# EAGLE design Sunrise (EAGLE 7.6.0)
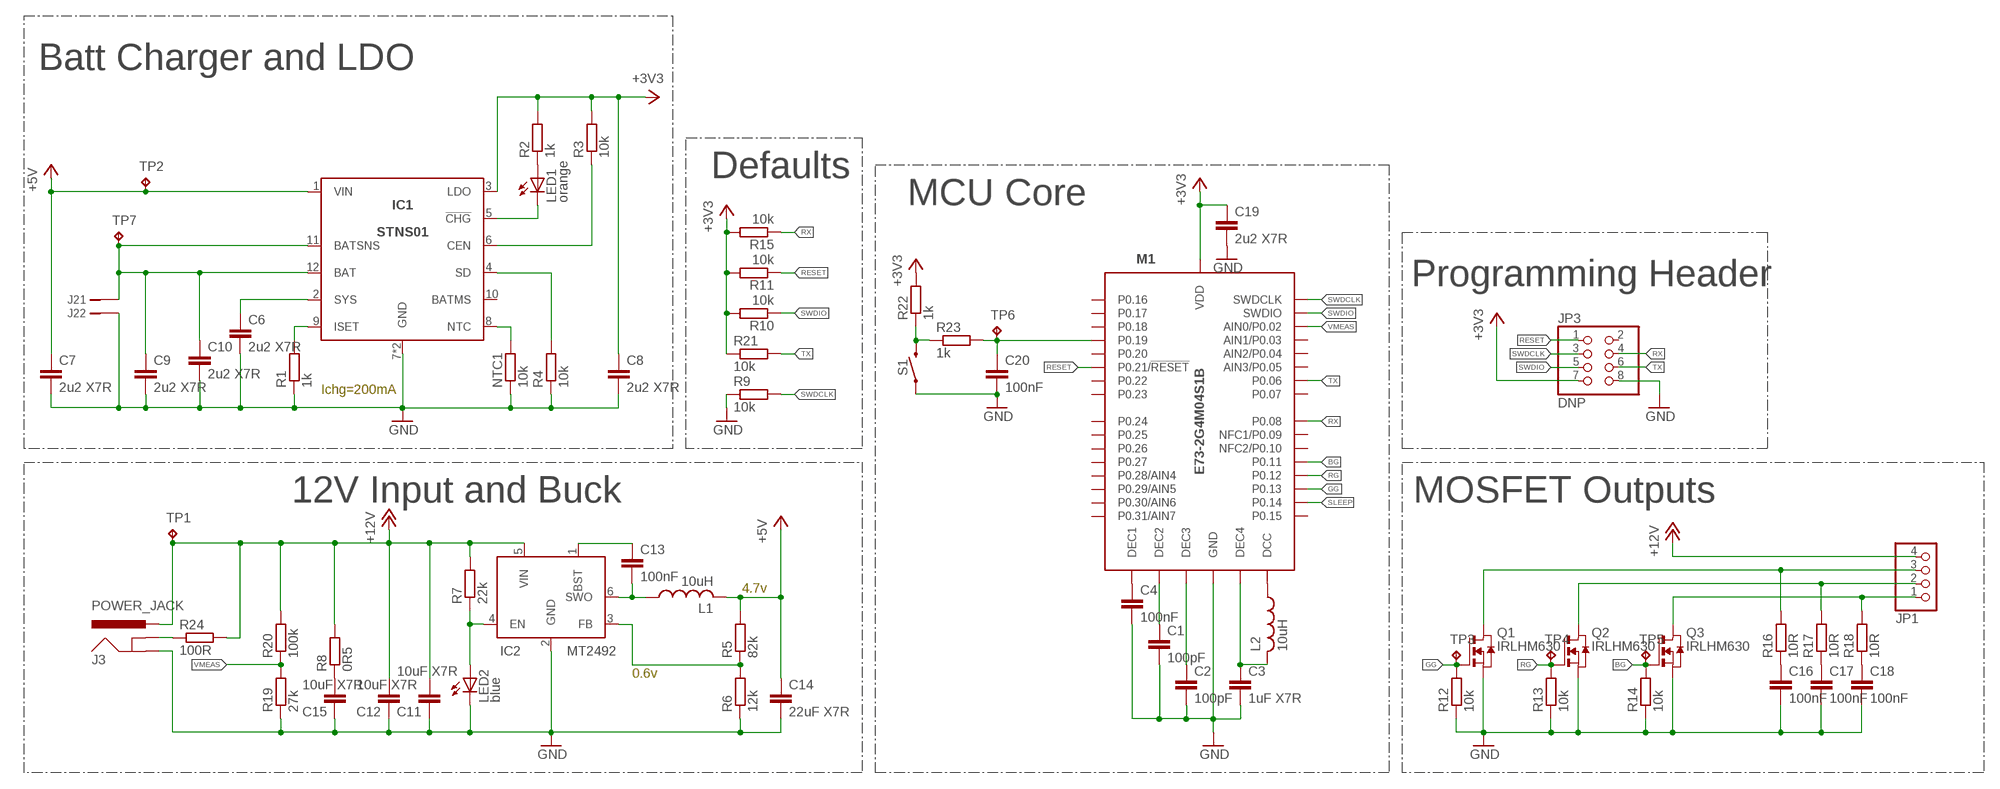
[diagram p0: schematic, sheet 1]

## Parts
C1  100pF  C-EUC0402K  [C0402K]
C2  100pF  C-EUC0402K  [C0402K]
C3  1uF X7R  C-EUC0603K  [C0603K]
C4  100nF  C-EUC0402K  [C0402K]
C6  2u2 X7R  C-EUC0603K  [C0603K]
C7  2u2 X7R  C-EUC0603K  [C0603K]
C8  2u2 X7R  C-EUC0603K  [C0603K]
C9  2u2 X7R  C-EUC0603K  [C0603K]
C10  2u2 X7R  C-EUC0603K  [C0603K]
C11  10uF X7R  C-EUC1206K  [C1206K]
C12  10uF X7R  C-EUC1206K  [C1206K]
C13  100nF  C-EUC0402K  [C0402K]
C14  22uF X7R  C-EUC1206K  [C1206K]
C15  10uF X7R  C-EUC1206K  [C1206K]
C16  100nF  C-EUC0402K  [C0402K]
C17  100nF  C-EUC0402K  [C0402K]
C18  100nF  C-EUC0402K  [C0402K]
C19  2u2 X7R  C-EUC0603K  [C0603K]
C20  100nF  C-EUC0402K  [C0402K]
IC1  STNS01  [DFN12L-3MM]
IC2  MT2492  [SOT23-6]
J2  B2B-PH-K-S  [B2B-PH-K-S]
J3  POWER_JACK  [POWER_JACK_PTH]
JP1  PINHD-1X4/90  [1X04/90]
JP3  DNP  PINHD-2X4  [2X04]
L1  10uH  INDUCTOR5050  [2020-5050]
L2  10uH  INDUCTOR1608  [0603-1608]
LED1  orange  LEDCHIP-LED0603  [CHIP-LED0603]
LED2  blue  LEDCHIP-LED0603  [CHIP-LED0603]
M1  E73-2G4M04S1B  [E73-2GM404S]
NTC1  10k  R-EU_R0402  [R0402]
Q1  IRLHM630  NMOS-MLP8-33  [MLP8-33]
Q2  IRLHM630  NMOS-MLP8-33  [MLP8-33]
Q3  IRLHM630  NMOS-MLP8-33  [MLP8-33]
R1  1k  R-EU_R0402  [R0402]
R2  1k  R-EU_R0402  [R0402]
R3  10k  R-EU_R0402  [R0402]
R4  10k  R-EU_R0402  [R0402]
R5  82k  R-EU_R0402  [R0402]
R6  12k  R-EU_R0402  [R0402]
R7  22k  R-EU_R0402  [R0402]
R8  0R5  R-EU_R0402  [R0402]
R9  10k  R-EU_R0402  [R0402]
R10  10k  R-EU_R0402  [R0402]
R11  10k  R-EU_R0402  [R0402]
R12  10k  R-EU_R0402  [R0402]
R13  10k  R-EU_R0402  [R0402]
R14  10k  R-EU_R0402  [R0402]
R15  10k  R-EU_R0402  [R0402]
R16  10R  R-EU_R0402  [R0402]
R17  10R  R-EU_R0402  [R0402]
R18  10R  R-EU_R0402  [R0402]
R19  27k  R-EU_R0402  [R0402]
R20  100k  R-EU_R0402  [R0402]
R21  10k  R-EU_R0402  [R0402]
R22  1k  R-EU_R0402  [R0402]
R23  1k  R-EU_R0402  [R0402]
R24  100R  R-EU_R0402  [R0402]
S1  MOMENTARY-SWITCH-SPST-SMD-5.2MM  [TACTILE_SWITCH_SMD_5.2MM]
TP1  TPTP10R  [TP10R]
TP2  TPTP10R  [TP10R]
TP3  TPTP10R  [TP10R]
TP4  TPTP10R  [TP10R]
TP5  TPTP10R  [TP10R]
TP6  TPTP10R  [TP10R]
TP7  TPTP10R  [TP10R]

## Nets
+3V3: C8.1 C19.1 IC1.3(LDO) JP3.7 M1.16(VDD) R2.2 R3.2 R10.2 R11.2 R15.2 R21.1 R22.2
+5V: C7.1 C14.1 IC1.1(VIN) L1.2 R5.2 TP2.TP
+12V: C11.1 C12.1 IC2.5(VIN) J3.PWR JP1.4 R7.2 R8.2 R20.2 R24.2 TP1.TP
BG: M1.26(P0.11) Q3.GATE(G) R14.2 TP5.TP
GG: M1.28(P0.13) Q1.GATE(G) R12.2 TP3.TP
GND: C1.2 C2.2 C3.2 C4.2 C6.2 C7.2 C8.2 C9.2 C10.2 C11.2 C12.2 C14.2 C15.2 C16.2 C17.2 C18.2 C19.2 C20.2 IC1.7(GND) IC1.PAD(GND) IC2.2(GND) J2.2 J3.GND JP3.8 LED2.C M1.0(GND) M1.1(GND) M1.2(GND) M1.15(GND) M1.42(GND) M1.43(GND) NTC1.1 Q1.S1(S) Q1.S2(S) Q1.S3(S) Q2.S1(S) Q2.S2(S) Q2.S3(S) Q3.S1(S) Q3.S2(S) Q3.S3(S) R1.1 R4.1 R6.1 R9.1 R12.1 R13.1 R14.1 R19.1 S1.1
N$1: C4.1 M1.14(DEC1)
N$2: C1.1 M1.3(DEC2)
N$3: C3.1 L2.2 M1.12(DEC4)
N$4: C2.1 M1.4(DEC3)
N$5: L2.1 M1.13(DCC)
N$6: C9.1 C10.1 IC1.11(BATSNS) IC1.12(BAT) J2.1 TP7.TP
N$7: C6.1 IC1.2(SYS)
N$8: IC1.8(NTC) NTC1.2
N$9: IC1.9(ISET) R1.2
N$10: LED1.A R2.1
N$11: IC1.5(!CHG) LED1.C
N$12: IC1.6(CEN) R3.1
N$13: IC1.4(SD) R4.2
N$14: C15.1 R8.1
N$15: JP1.1 Q3.D1(D) Q3.D2(D) Q3.D3(D) Q3.D4(D) Q3.DRAIN0(D) R18.2
N$16: JP1.2 Q2.D1(D) Q2.D2(D) Q2.D3(D) Q2.D4(D) Q2.DRAIN0(D) R17.2
N$17: C13.1 IC2.1(BST)
N$18: IC2.3(FB) R5.1 R6.2
N$19: JP1.3 Q1.D1(D) Q1.D2(D) Q1.D3(D) Q1.D4(D) Q1.DRAIN0(D) R16.2
N$20: C13.2 IC2.6(SWO) L1.1
N$21: IC2.4(EN) LED2.A R7.1
N$22: C16.1 R16.1
N$23: C17.1 R17.1
N$24: C18.1 R18.1
N$25: R22.1 R23.1 S1.3
N$26: C20.1 M1.34(P0.19) R23.2 TP6.TP
N$27: J3.GNDBREAK R24.1
RESET: JP3.1 M1.36(P0.21/!RESET) R11.1
RG: M1.27(P0.12) Q2.GATE(G) R13.2 TP4.TP
RX: JP3.4 M1.23(P0.08) R15.1
SLEEP: M1.29(P0.14)
SWDCLK: JP3.3 M1.37(SWDCLK) R9.2
SWDIO: JP3.5 M1.38(SWDIO) R10.1
TX: JP3.6 M1.21(P0.06) R21.2
VMEAS: M1.17(AIN0/P0.02) R19.2 R20.1
Unconnected: IC1.10(BATMS) JP3.2 M1.5(P0.25) M1.6(P0.26) M1.7(P0.27) M1.8(P0.28/AIN4) M1.9(P0.29/AIN5) M1.10(P0.30/AIN6) M1.11(P0.31/AIN7) M1.18(AIN1/P0.03) M1.19(AIN2/P0.04) M1.20(AIN3/P0.05) M1.22(P0.07) M1.24(NFC1/P0.09) M1.25(NFC2/P0.10) M1.30(P0.15) M1.31(P0.16) M1.32(P0.17) M1.33(P0.18) M1.35(P0.20) M1.39(P0.22) M1.40(P0.23) M1.41(P0.24)

## Notes on the sheet
- Batt Charger and LDO
- Defaults
- MCU Core
- Programming Header
- Ichg=200mA
- 12V Input and Buck | MOSFET Outputs
- 4.7v
- 0.6v

## Library data of the parts
C1-C4 C6-C20 = rcl:C-EU: CAPACITOR, European symbol
IC1 = STNS01:STNS01; MF: ST; MPN: STNS01
IC2 = MT2492:MT2492; MF: Monolithic Power; MPN: MT2492
J2 = con-JST-PH:B2B-PH-K-S: JST-PH 2-way vertical TH; MF: JST; MPN: B2B-PH-K-S
J3 = SparkFun-Connectors:POWER_JACK: Power Jack Connector This is the standard 5.5mm barrel jack for power. The PTH is the most common, proven, reliable, footprint. The Slot footprint only works if the mill layer is transmitted to the PCB fab house so be warned. Here are the connectors we sell at SparkFun: DC Barrel Power Jack/Connector <https://www.sparkfun.com/products/119> (PRT-00119) DC Barrel Power Jack/Connector (SMD) <https://www.sparkfun.com/products/12748> (PRT-12748) DC Barrel Jack Adapter - Breadboard Compatible <https://www.sparkfun.com/products/10811> (PRT-10811) It is used on this SparkFun product (and many, many others): SparkFun RedBoard - Programmed with Arduino <https://www.sparkfun.com/products/12757> (DEV-12757) Also, if you need a mating power supply or connector, please check these out: Wall Adapter Power Supply - 9VDC 650mA <https://www.sparkfun.com/products/298> (TOL-00298) DC Barrel Jack Adapter - Male <https://www.sparkfun.com/products/10287> (PRT-10287); PROD_ID: CONN-08197
JP1 = pinhead:PINHD-1X4: PIN HEADER
JP3 = pinhead:PINHD-2X4: PIN HEADER
L1 = inductors-murata:INDUCTOR; MF: Murata; MPN: LQH5BPN100MT0
L2 = inductors-murata:INDUCTOR; CURRENT: >50mA
LED1 LED2 = led:LED: LED OSRAM: - CHIPLED LG R971, LG N971, LY N971, LG Q971, LY Q971, LO R971, LY R971 LH N974, LH R974 LS Q976, LO Q976, LY Q976 LO Q996 - Hyper CHIPLED LW Q18S LB Q993, LB Q99A, LB R99A - SideLED LS A670, LO A670, LY A670, LG A670, LP A670 LB A673, LV A673, LT A673, LW A673 LH A674 LY A675 LS A676, LA A676, LO A676, LY A676, LW A676 LS A679, LY A679, LG A679 - Hyper Micro SIDELED® LS Y876, LA Y876, LO Y876, LY Y876 LT Y87S - SmartLED LW L88C, LW L88S LB L89C, LB L89S, LG L890 LS L89K, LO L89K, LY L89K LS L896, LA L896, LO L896, LY L896 - TOPLED LS T670, LO T670, LY T670, LG T670, LP T670 LSG T670, LSP T670, LSY T670, LOP T670, LYG T670 LG T671, LOG T671, LSG T671 LB T673, LV T673, LT T673, LW T673 LH T674 LS T676, LA T676, LO T676, LY T676, LB T676, LH T676, LSB T676, LW T676 LB T67C, LV T67C, LT T67C, LS T67K, LO T67K, LY T67K, LW E67C LS E67B, LA E67B, LO E67B, LY E67B, LB E67C, LV E67C, LT E67C LW T67C LS T679, LY T679, LG T679 LS T770, LO T770, LY T770, LG T770, LP T770 LB T773, LV T773, LT T773, LW T773 LH T774 LS E675, LA E675, LY E675, LS T675 LS T776, LA T776, LO T776, LY T776, LB T776 LHGB T686 LT T68C, LB T68C - Hyper Mini TOPLED® LB M676 - Mini TOPLED Santana® LG M470 LS M47K, LO M47K, LY M47K Source: http://www.osram.convergy.de LUXEON: - LUMILED® LXK2-PW12-R00, LXK2-PW12-S00, LXK2-PW14-U00, LXK2-PW14-V00 LXK2-PM12-R00, LXK2-PM12-S00, LXK2-PM14-U00 LXK2-PE12-Q00, LXK2-PE12-R00, LXK2-PE12-S00, LXK2-PE14-T00, LXK2-PE14-U00 LXK2-PB12-K00, LXK2-PB12-L00, LXK2-PB12-M00, LXK2-PB14-N00, LXK2-PB14-P00, LXK2-PB14-Q00 LXK2-PR12-L00, LXK2-PR12-M00, LXK2-PR14-Q00, LXK2-PR14-R00 LXK2-PD12-Q00, LXK2-PD12-R00, LXK2-PD12-S00 LXK2-PH12-R00, LXK2-PH12-S00 LXK2-PL12-P00, LXK2-PL12-Q00, LXK2-PL12-R00 Source: www.luxeon.com KINGBRIGHT: KA-3528ASYC Source: www.kingbright.com
M1 = E73-2G4M04S:E73-2G4M04S: NRF52 Module With Antenna variants: 1A: NRF52810 <http://www.ebyte.com/product-view-news.aspx?id=305> FLASH: 192kb RAM: 24kb CORE: ARM Cortex-M4 1B: NRF52832 <http://www.ebyte.com/product-view-news.aspx?id=239> FLASH: 512kb RAM: 64kb CORE: ARM Cortex-M4F 1C: NRF52840 <http://www.ebyte.com/product-view-news.aspx?id=444> FLASH: 1024kb RAM: 256kb CORE: ARM Cortex-M4; MF: Chengdu Ebyte; MPN: E7302G4M04S1B
NTC1 R1-R24 = rcl:R-EU_: RESISTOR, European symbol
Q1-Q3 = MOSFET:NMOS; MF: International Rectifier; MPN: IRLHM630TRPbF
S1 = SparkFun-Switches:MOMENTARY-SWITCH-SPST: Momentary Switch (Pushbutton) - SPST Normally-open (NO) SPST momentary switches (buttons, pushbuttons). Variants PTH-12MM - 12mm square, through-hole Momentary Pushbutton Switch - 12mm Square <https://www.sparkfun.com/products/9190> (COM-09190) PTH-6.0MM, PTH-6.0MM-KIT - 6.0mm square, through-hole Mini Pushbutton Switch <https://www.sparkfun.com/products/97> (COM-00097) KIT package intended for soldering kit's - only one side of pads' copper is exposed. PTH-RIGHT-ANGLE-KIT - Right-angle, through-hole Right Angle Tactile Button <https://www.sparkfun.com/products/10791> - Used on SparkFun BigTime Watch Kit <https://www.sparkfun.com/products/11734> SMD-12MM - 12mm square, surface-mount Tactile Button - SMD (12mm) <https://www.sparkfun.com/products/12993> (COM-12993) Used on SparkFun PicoBoard <https://www.sparkfun.com/products/11888> SMD-4.5MM - 4.5mm Square Trackball Switch Used on SparkFun Blackberry Trackballer Breakout <https://www.sparkfun.com/products/13169> SMD-4.6MMX2.8MM - 4.60mm x 2.80mm, surface mount Used on SparkFun SAMD21 Mini Breakout <https://www.sparkfun.com/products/13664> SMD-5.2MM, SMD-5.2-REDUNDANT - 5.2mm square, surface-mount Mini Pushbutton Switch - SMD <https://www.sparkfun.com/products/8720> (COM-08720) Used on Arduino Pro Mini <https://www.sparkfun.com/products/11114> REDUNDANT package connects both switch circuits together SMD-6.0X3.5MM - 6.0 x 3.5mm, surface mount Momentary Reset Switch SMD <https://www.sparkfun.com/products/8229> (COM-08229) SMD-6.2MM-TALL - 6.2mm square, surface mount Tactile Button - SMD (6mm) <https://www.sparkfun.com/products/12992> Used on SparkFun Digital Sandbox <https://www.sparkfun.com/products/12651> SMD-RIGHT-ANGLE - Right-angle, surface mount Used on SparkFun Block for Intel® Edison - Arduino <https://www.sparkfun.com/products/13036>; PROD_ID: SWCH-08247; SF_SKU: COM-08720
TP1-TP7 = testpad:TP: Test pad

## Board
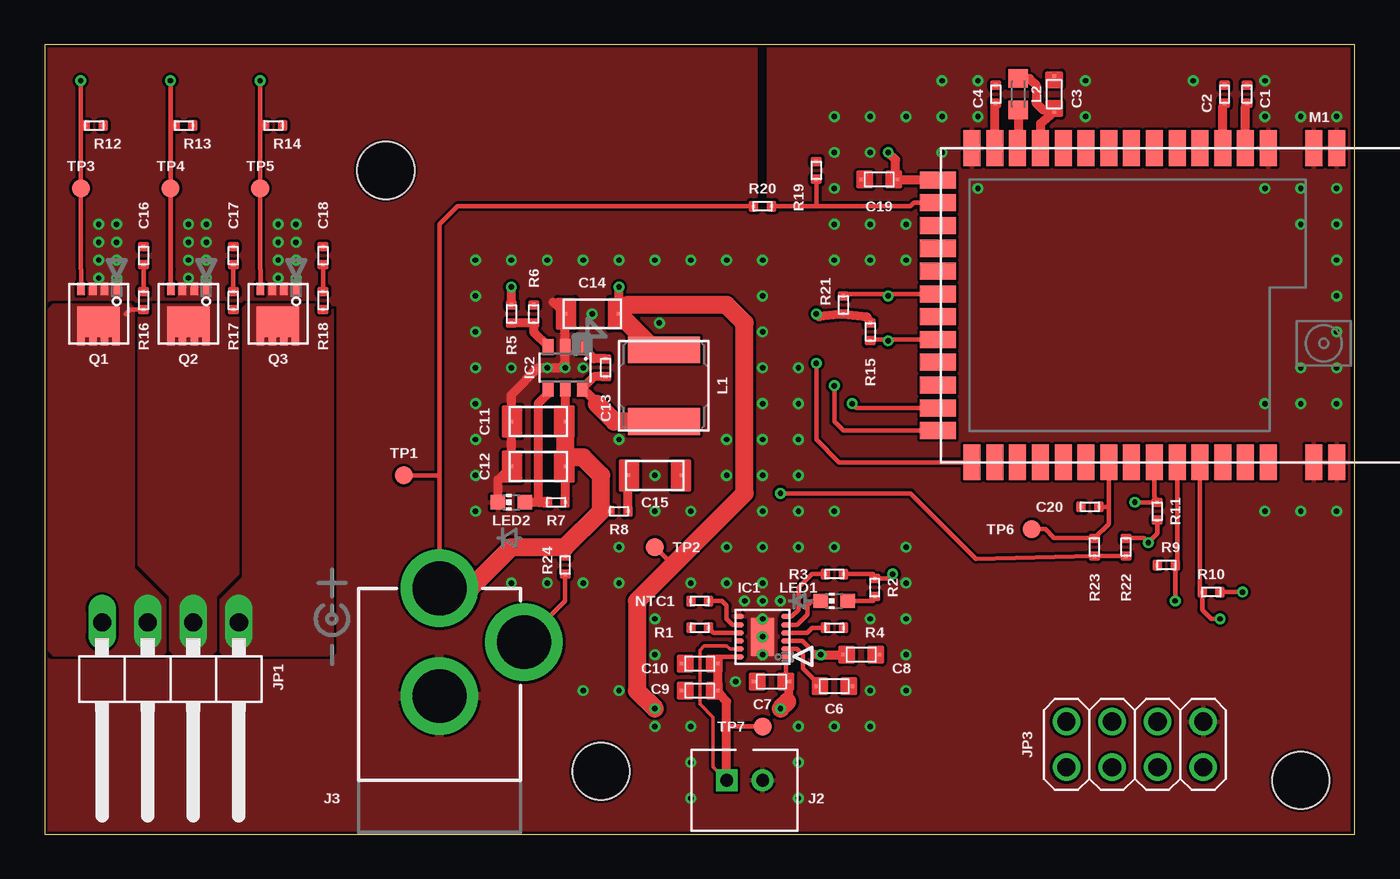
[diagram p1: board, top side]
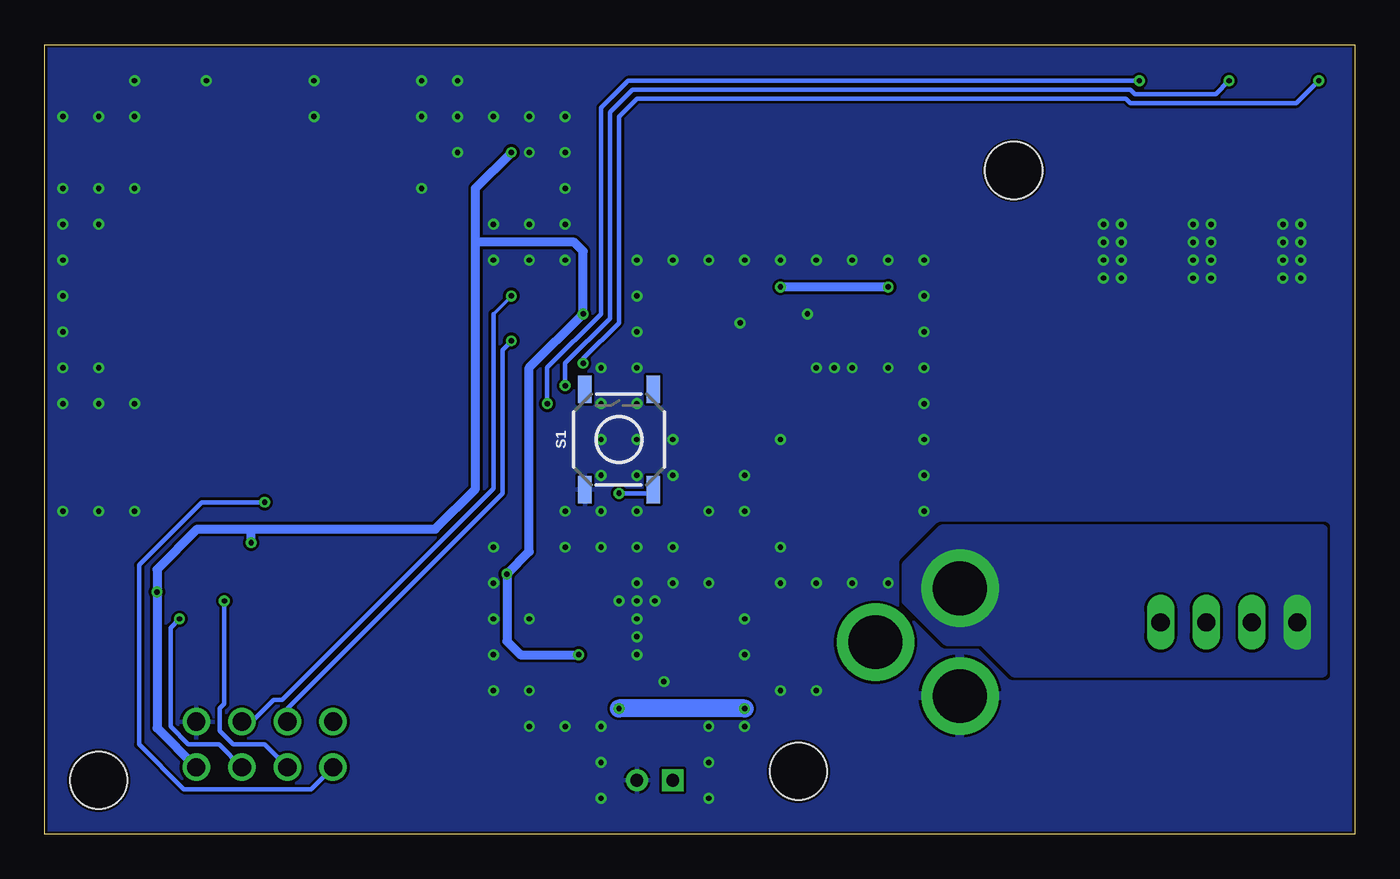
[diagram p2: board, bottom side, seen from below]

Size 73 x 44 mm. Coordinates in mm from the lower left corner, seen from the top.
Outline: 0,0 73,0 73,44 0,44 0,0
Copper layers (1*16): Top 0.035mm / dielectric 1.5mm / Bottom 0.035mm
Design rules "eagle-7 *": minimum track width 6mil, minimum drill 0.3mm, track to track 6mil, track to pad 6mil, pad to pad 6mil, via to via 6mil, smd to smd 0mil, copper to edge 6mil, drill to drill 6mil, minimum pad ring 10mil, minimum via ring 6mil, stop-mask expansion 2mil, vias tented up to drill 0.35mm, thermal gap 6mil
Holes 3.2 mm at 70,3 19,37 31,3.5
tKeepout: area 66.5,-0.5 to 73.5,6.5; area 15.5,33.5 to 22.5,40.5; area 27.5,0 to 34.5,7
bKeepout: area 27.5,0 to 34.5,7; area 66.5,-0.5 to 73.5,6.5; area 15.5,33.5 to 22.5,40.5
tRestrict: 1 lines

### Footprints (pad centres in the part's own frame; a part is rotated, then mirrored left to right if it is on the bottom)
C0402K = smd 0.2 x 0.2: 1 -0.5,0; 2 0.5,0
C0603K = smd 0.2 x 0.2: 1 -1,0; 2 1,0
C1206K = smd 0.2 x 0.2: 1 -1.5,0; 2 1.5,0
DFN12L-3MM = smd 0.5 x 0.3: 1 -1.3,1.125; 2 -1.3,0.675; 3 -1.3,0.225; 4 -1.3,-0.225; 5 -1.3,-0.675; 6 -1.3,-1.125; 7 1.3,-1.125; 8 1.3,-0.675; 9 1.3,-0.225; 10 1.3,0.225; 11 1.3,0.675; 12 1.3,1.125 | smd 1.31 x 2.12: PAD 0,0
SOT23-6 = smd 0.6 x 0.9: 1 -0.95,-1.15; 2 0,-1.15; 3 0.95,-1.15; 4 0.95,1.15; 5 0,1.15; 6 -0.95,1.15
B2B-PH-K-S = drill 0.7 square: 1 1,0 | drill 0.7: 2 -1,0
POWER_JACK_PTH = drill 2.997 pad 4.318: GND 0,7.7; GNDBREAK 4.7,10.7; PWR 0,13.7
1X04/90 = drill 1.016 long: 1 -3.81,-3.81; 2 -1.27,-3.81; 3 1.27,-3.81; 4 3.81,-3.81
2X04 = drill 1.016: 1 -3.81,-1.27; 2 -3.81,1.27; 3 -1.27,-1.27; 4 -1.27,1.27; 5 1.27,-1.27; 6 1.27,1.27; 7 3.81,-1.27; 8 3.81,1.27
2020-5050 = smd 1.5 x 4: 1 -2,0; 2 2,0
0603-1608 = smd 1.05 x 1.08: 1 -0.875,0; 2 0.875,0
CHIP-LED0603 = smd 0.8 x 0.8: A 0,-0.75; C 0,0.75
E73-2GM404S = smd 0.95 x 2: 0 7.715,8.75; 1 6.445,8.75; 2 3.905,8.75; 3 2.635,8.75; 4 1.365,8.75; 5 0.095,8.75; 6 -1.175,8.75; 7 -2.445,8.75; 8 -3.715,8.75; 9 -4.985,8.75; 10 -6.255,8.75; 11 -7.525,8.75; 12 -8.795,8.75; 13 -10.065,8.75; 14 -11.335,8.75; 15 -12.605,8.75; 28 -12.605,-8.75; 29 -11.335,-8.75; 30 -10.065,-8.75; 31 -8.795,-8.75; 32 -7.525,-8.75; 33 -6.255,-8.75; 34 -4.985,-8.75; 35 -3.715,-8.75; 36 -2.445,-8.75; 37 -1.175,-8.75; 38 0.095,-8.75; 39 1.365,-8.75; 40 2.635,-8.75; 41 3.905,-8.75; 42 6.445,-8.75; 43 7.715,-8.75 | smd 2 x 0.95: 16 -14.5,6.985; 17 -14.5,5.715; 18 -14.5,4.445; 19 -14.5,3.175; 20 -14.5,1.905; 21 -14.5,0.635; 22 -14.5,-0.635; 23 -14.5,-1.905; 24 -14.5,-3.175; 25 -14.5,-4.445; 26 -14.5,-5.715; 27 -14.5,-6.985
R0402 = smd 0.2 x 0.2: 1 -0.5,0; 2 0.5,0
MLP8-33 = smd 0.42 x 0.45: D1 -0.975,1.525; D2 -0.325,1.525; D3 0.325,1.525; D4 0.975,1.525 | smd 2.37 x 1.7: DRAIN0 0,0.45 | smd 0.42 x 0.7: GATE 0.975,-1.4; S1 -0.975,-1.4; S2 -0.325,-1.4; S3 0.325,-1.4
TACTILE_SWITCH_SMD_5.2MM = smd 1.524 x 0.762: 1 -2.794,1.905; 2 2.794,1.905; 3 -2.794,-1.905; 4 2.794,-1.905
TP10R = smd 1 x 1: TP 0,0

### Placement (x,y rotation side)
C1  67,41.25 90 top
C2  65.75,41.25 90 top
C3  56.25,41.25 90 top
C4  53,41.25 90 top
C6  44,8.25 0 top
C7  40.5,8.5 180 top
C8  45.5,10 0 top
C9  36.5,8 180 top
C10  36.5,9.5 180 top
C11  27.5,23 180 top
C12  27.5,20.5 180 top
C13  31.25,26 270 top
C14  30.5,29 180 top
C15  34,20 0 top
C16  5.5,32.25 90 top
C17  10.5,32.25 90 top
C18  15.5,32.25 90 top
C19  46.5,36.5 180 top
C20  58.25,18.25 180 top
IC1  40,11 180 top
IC2  29,26 180 top
J2  39,3 180 top
J3  22,0 0 top
JP1  7,8 180 top
JP3  60.75,5 0 top
L1  34.5,25 90 top
L2  54.25,41.25 90 top
LED1  44,13 90 top
LED2  26,18.5 90 top
M1  64.28,29.48 0 top
NTC1  36.5,13 0 top
Q1  3,29 180 top
Q2  8,29 180 top
Q3  13,29 180 top
R1  36.5,11.5 0 top
R2  46.25,13.75 90 top
R3  44,14.5 0 top
R4  44,11.5 180 top
R5  26,29 90 top
R6  27.25,29 270 top
R7  28.5,18.5 0 top
R8  32,18 180 top
R9  62.5,15 0 top
R10  65,13.5 0 top
R11  62,18 270 top
R12  2.75,39.5 180 top
R13  7.75,39.5 180 top
R14  12.75,39.5 180 top
R15  46,28 90 top
R16  5.5,29.75 270 top
R17  10.5,29.75 270 top
R18  15.5,29.75 270 top
R19  43,37 270 top
R20  40,35 180 top
R21  44.5,29.5 90 top
R22  60.25,16 90 top
R23  58.5,16 90 top
R24  29,15 90 top
S1  41,22 90 bottom
TP1  20,20 0 top
TP2  34,16 0 top
TP3  2,36 0 top
TP4  7,36 0 top
TP5  12,36 0 top
TP6  55,17 0 top
TP7  40,6 0 top

### Tracks (layer width: path | path; a pad name or v marks a point on that pad's centre or on a via)
+3V3  (via drill 0.3)
  Top 0.25: 43,10 42.23,10.78 IC1.3 | R3.2 46.15,14.5 R2.2 47,14.25 v47.25,14.5 | R10.2 v66.75,13.5 | R11.2 62,16.75 v61.5,16.25 61.25,16.5 R22.2
  Top 0.5: 43,10 v43.25,10 C8.1 | M1.16 47.41,36.47 | 47.41,36.47 C19.1 | R15.2 45.8,28.85 R21.1 43.15,28.85 v43,29 | 47.41,36.47 47.41,37.59 v47,38
  Bottom 0.5: v43.25,10 46.5,10 47.25,10.75 v47.25,14.5 46,15.75 46,26 v43,29 43,32.5 43.5,33 49,33 | 49,33 49,19.25 51.25,17 61.5,17 | 49,33 49,36 v47,38 | JP3.7 66.75,5.92 v66.75,13.5 66.75,14.75 64.5,17 61.5,17 | v61.5,16.25 61.5,17
+5V  (via drill 0.3)
  Top 0.25: IC1.1 41.3,8.57 C7.1 | TP2.TP 35,15
  Top 0.5: R5.2 v26,30.5 | C14.1 v32,30.5 | C7.1 41.38,7.38
  Top 1: L1.2 34,27 C14.1 32.5,29.5 38,29.5 39,28.5 39,19 35,15 33,13 33,8 v34,7 | 41.38,7.38 v41,7
  Bottom 0.5: v26,30.5 v32,30.5
  Bottom 1: v34,7 v41,7
+12V
  Top 0.25: R20.2 23,35 22,34 22,20 | J3.PWR 22,20 | R24.2 29,16 | TP1.TP 22,20
  Top 0.5: IC2.5 C11.1 | R8.2 31,18 | C12.1 R7.2
  Top 1: C11.1 29,21 | 29,21 C12.1 | J3.PWR 23.7,13.7 26,16 29,16 31,18 31,20 30,21 29,21
  pour Bottom (rank 5, no thermals): 1.75,17 23,17 25,15 25,13 22.75,10.75 20.75,10.75 19,9 1.75,9
BG  (via drill 0.3)
  Top 0.25: M1.26 45.23,23.77 v45,24 | Q3.GATE 12.03,31.48 12,31.5 TP5.TP 12,39.5 | 12,39.5 v12,42 | R14.2 12,39.5
  Bottom 0.25: v45,24 45,26 42,29 42,40.5 40.5,42 v12,42
GG  (via drill 0.3)
  Top 0.25: M1.28 44.27,20.73 43,22 v43,26.25 | Q1.GATE 2.02,31.48 2,31.5 TP3.TP 2,39.5 | 2,39.5 v2,42 | R12.2 2,39.5
  Bottom 0.25: v43,26.25 43,26.5 41,28.5 41,40 40,41 12.75,41 12.5,40.75 3.25,40.75 v2,42
GND  (via drill 0.3)
  Top 0.5: 28.35,29.65 C14.2 IC2.2 29,26.25 28.75,26 27.5,26 26,24.5 C11.2 C12.2 25.25,19.75 LED2.C
  other vias: 40,13 40,12 40,11 40,10 39,13 41,13 40,16 38,16 40,18 42,18 42,16 44,16 44,18 40,20 42,20 42,22 42,24 42,26 40,26 40,24 40,22 40,30 40,32 38,32 36,32 34,32 32,32 30,32 28,32 26,32 24,32 24,30 24,28 24,26 24,24 26,26 24,18 24,20 24,22 44,32 46,32 46,34 48,34 48,32 68,40 70,40 72,40 72,36 70,36 68,36 68,24 70,24 72,24 72,18 70,18 68,18 70,26 72,26 72,28 72,30 72,32 72,34 70,34 52,36 52,40 52,42 58,42 64,42 68,42 40,14 38,14 36,14 34,12 34,10 38.5,8.5 46,12 48,12 48,10 46,8 44,6 42,6 36,6 34,6 46,6 48,8 34,20 28,26 29,26 30,26 8,31 9,31 3,31 4,31 14,31 13,31 3,32 4,32 4,33 3,33 3,34 4,34 8,32 8,33 8,34 9,32 9,33 9,34 13,32 13,33 13,34 14,32 14,33 14,34 34.25,28.5 30.5,29 50,42 50,40 50,38 44,38 46,40 44,36 44,34 40,28 48,40 44,40 46,38 28,14 26,14 32,16 32,14 30,14 30,8 32,8 48,16 48,14 34,18 36,18 38,20 38,22 32,22 36,4 36,2 42,4 42,2 58,40
  pour Top (no thermals): 30.25,30.5 30.25,25.25 27.75,25.25 27,24.5 27,19.5 24,19.5 24,26 26,28 27.75,28 28,28.25 28,30.5
  pour Top (rank 6): 48,6 34,6 34,16 48,16
  pour Top (rank 6): 32,32 32,17 23,17 23,32
  pour Top (rank 6): -1,60 74,60 74,-1 -1,-1
  pour Bottom (rank 6): -2,61 75,61 75,-2 -2,-2
  pour Top (rank 6, no thermals): 1,32 18,32 18,29 1,29
  pour Top (rank 6): 19.25,11 25.25,11 25.25,4.75 19.25,4.75
  pour Bottom (rank 6): 19.25,11 25.25,11 25.25,4.75 19.25,4.75
  pour Top (rank 6, no thermals): 39.25,13 40.75,13 40.75,9.5 39.25,9.5
N$1
  Top 0.5: M1.14 52.95,40.59 C4.1
N$2
  Top 0.5: M1.3 66.92,40.56 C1.1
N$3
  Top 0.5: L2.2 54.88,42.12 55.25,41.75 55.25,40.75 55.62,40.38 C3.1 55.48,39.61 M1.12
N$4
  Top 0.5: M1.4 65.64,40.55 C2.1
N$5
  Top 0.5: L2.1 54.25,38.27 M1.13
N$6
  Top 0.2: IC1.11 38.17,10.32 38,10.5 36.75,10.5 36.5,10.25 36.5,7.25 37.25,6.5 37.25,3.75 J2.1
  Top 0.25: IC1.12 37.75,9.88 C10.1 | TP7.TP 38,6
  Top 0.5: C10.1 C9.1 38,7.38 38,6 J2.1
N$7
  Top 0.25: C6.1 43,8.5 42.25,9.25 42.25,10 41.92,10.32 IC1.2
N$8
  Top 0.25: IC1.8 38.33,11.68 38,12 38,12.75 37.75,13 NTC1.2
N$9
  Top 0.25: IC1.9 37.27,11.22 R1.2
N$10
  Top 0.25: LED1.A 46.15,13 R2.1
N$11
  Top 0.25: IC1.5 41.92,11.68 42.5,12.25 42.5,12.75 42.75,13 LED1.C
N$12
  Top 0.25: IC1.6 41.62,12.12 42,12.5 42,13.75 42.75,14.5 R3.1
N$13
  Top 0.25: IC1.4 42.48,11.22 42.75,11.5 R4.2
N$14
  Top 0.5: R8.1 C15.1
N$15
  pour Top (rank 5, no thermals): 11,14.5 11,29.25 11.25,29.5 15.75,29.5 16,29.25 16,10.25 15.75,10 10,10 9.75,10.25 9.75,13.25
N$16
  pour Top (rank 4, no thermals): 9.5,13.25 9.5,10.25 9.25,10 7.25,10 7,10.25 7,13.25 5.25,15 5.25,29.25 5.5,29.5 10.5,29.5 10.75,29.25 10.75,14.5
N$17
  Top 0.5: IC2.1 30.6,26.5 C13.1
N$18
  Top 0.5: IC2.3 28.05,27.2 27.25,28 R6.2 R5.1
N$19
  Top 0.25: R16.2 4.75,29.25 4.5,29
  pour Top (rank 5, no thermals): 0.5,10 6.5,10 6.75,10.25 6.75,13.25 5,15 5,29.25 4.75,29.5 0.5,29.5 0.25,29.25 0.25,10.25
N$20
  Top 0.5: 30.75,24 30.5,24.3 IC2.6 30.6,25.5 C13.2
  Top 1: L1.1 31.75,23 30.75,24
N$21
  Top 0.5: IC2.4 28.05,24.55 27.5,24 27.5,18.5 | 27.5,18.5 R7.1 | 27.5,18.5 LED2.A
N$22
  Top 0.25: R16.1 C16.1
N$23
  Top 0.25: C17.1 R17.1
N$24
  Top 0.25: R18.1 C18.1
N$25  (via drill 0.3)
  Top 0.25: v41,19 48.25,19 51.9,15.35 R23.1 R22.1
  Bottom 0.25: v41,19 39.3,19 S1.3
N$26
  Top 0.25: M1.34 59.3,18.25 | 59.3,18.25 59.3,17.3 R23.2 56.25,16.5 55.75,17 TP6.TP | C20.1 59.3,18.25
N$27
  Top 0.25: R24.1 29,13 J3.GNDBREAK
RESET  (via drill 0.3)
  Top 0.25: M1.36 61.84,18.82 R11.1 v60.75,18.5
  Bottom 0.25: v60.75,18.5 64.25,18.5 67.75,15 67.75,5 65.25,2.5 58.17,2.5 JP3.1
RG  (via drill 0.3)
  Top 0.25: M1.27 44.51,22.5 44,23 v44,25 | Q2.GATE 7.03,31.48 7,31.5 TP4.TP 7,39.5 | 7,39.5 v7,42 | R13.2 7,39.5
  Bottom 0.25: v44,25 44,26.25 41.5,28.75 41.5,40.25 40.25,41.5 12.5,41.5 12.25,41.25 7.75,41.25 v7,42
RX  (via drill 0.3)
  Top 0.2: M1.23 47.08,27.57 v47,27.5
  Top 0.25: M1.23 46.23,27.57 R15.1
  Bottom 0.25: v47,27.5 47.5,27 47.5,19 59.48,7.02 JP3.4
SWDCLK  (via drill 0.3)
  Top 0.25: M1.37 63.1,15.04 R9.2 v63,13
  Bottom 0.25: v63,13 63,7.25 63.25,7 63.25,5.75 62.5,5 60.75,5 JP3.3
SWDIO  (via drill 0.3)
  Top 0.25: M1.38 64.38,13.53 R10.1 64.5,12.5 65,12 v65.5,12
  Bottom 0.25: v65.5,12 66,11.5 66,6 65,5 63.29,5 JP3.5
TX  (via drill 0.3)
  Top 0.2: M1.21 47.12,30.11 v47,30
  Top 0.25: M1.21 44.53,30.11 R21.2
  Bottom 0.2: v47,30 48,29
  Bottom 0.25: 48,29 48,19.27 59.77,7.5 60.25,7.5 61.48,6.27 JP3.6
VMEAS
  Top 0.25: M1.17 48.45,35.2 48.25,35 43,35 | R19.2 43,35 | R20.1 43,35

### Text on the board
tDocu: + G R B | RX | TX | GND | 12v | + | RST SCK SWD 3v3
bDocu: SunriseLamp / v0.1 | by Triffid Hunter